# EAGLE design BackplaneBoard (EAGLE 9.1.3)
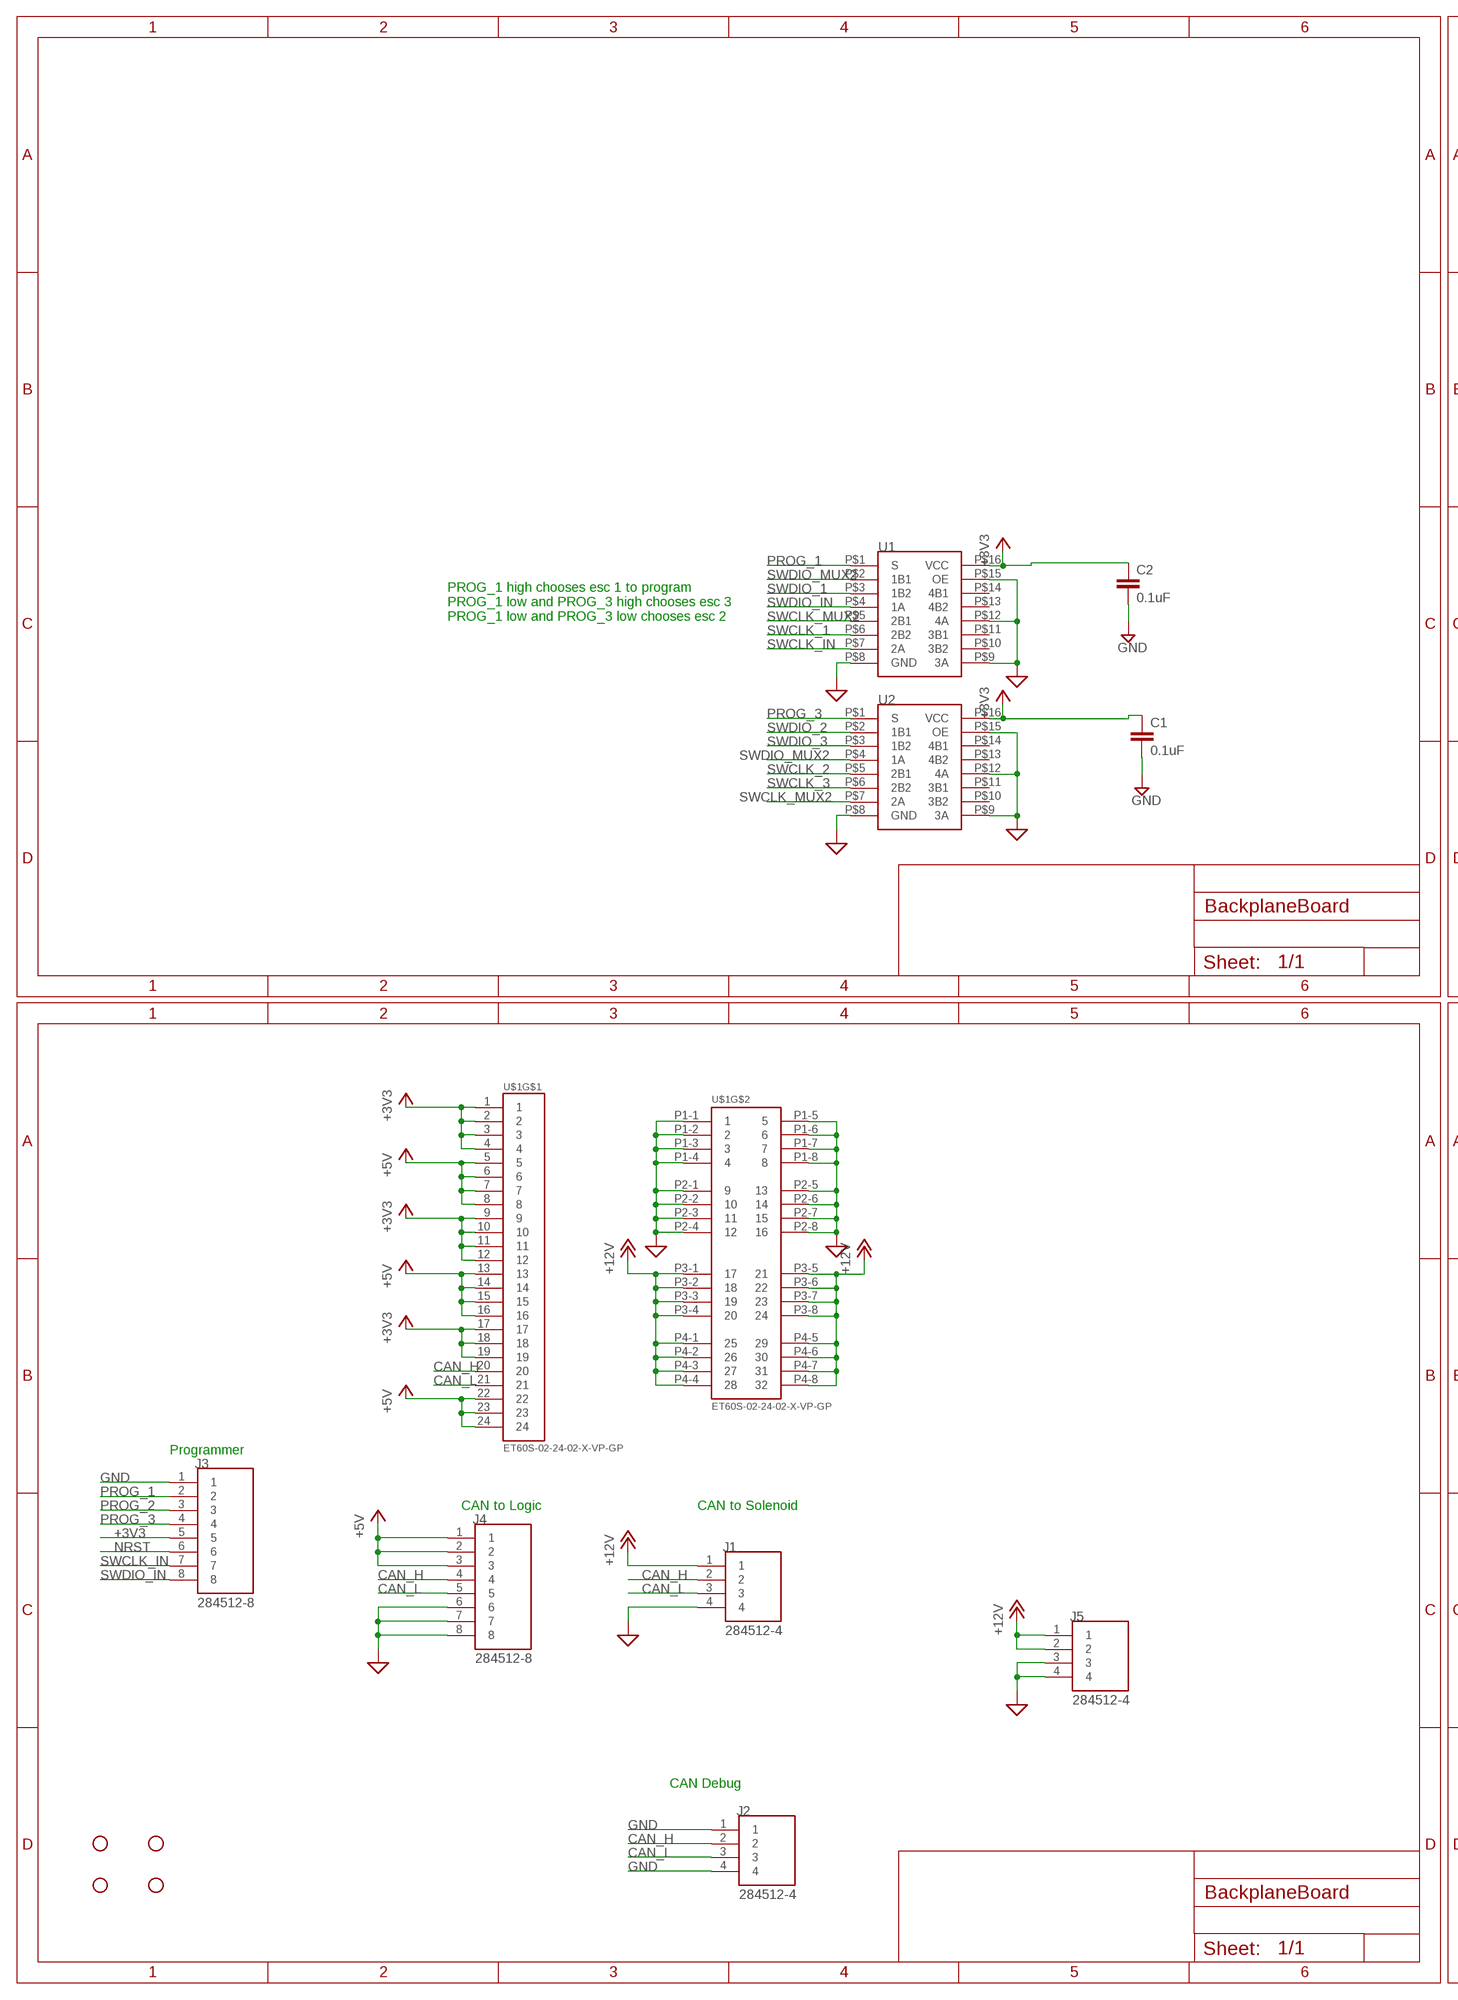
[diagram p0: schematic, sheet 1, part 1 of 2]
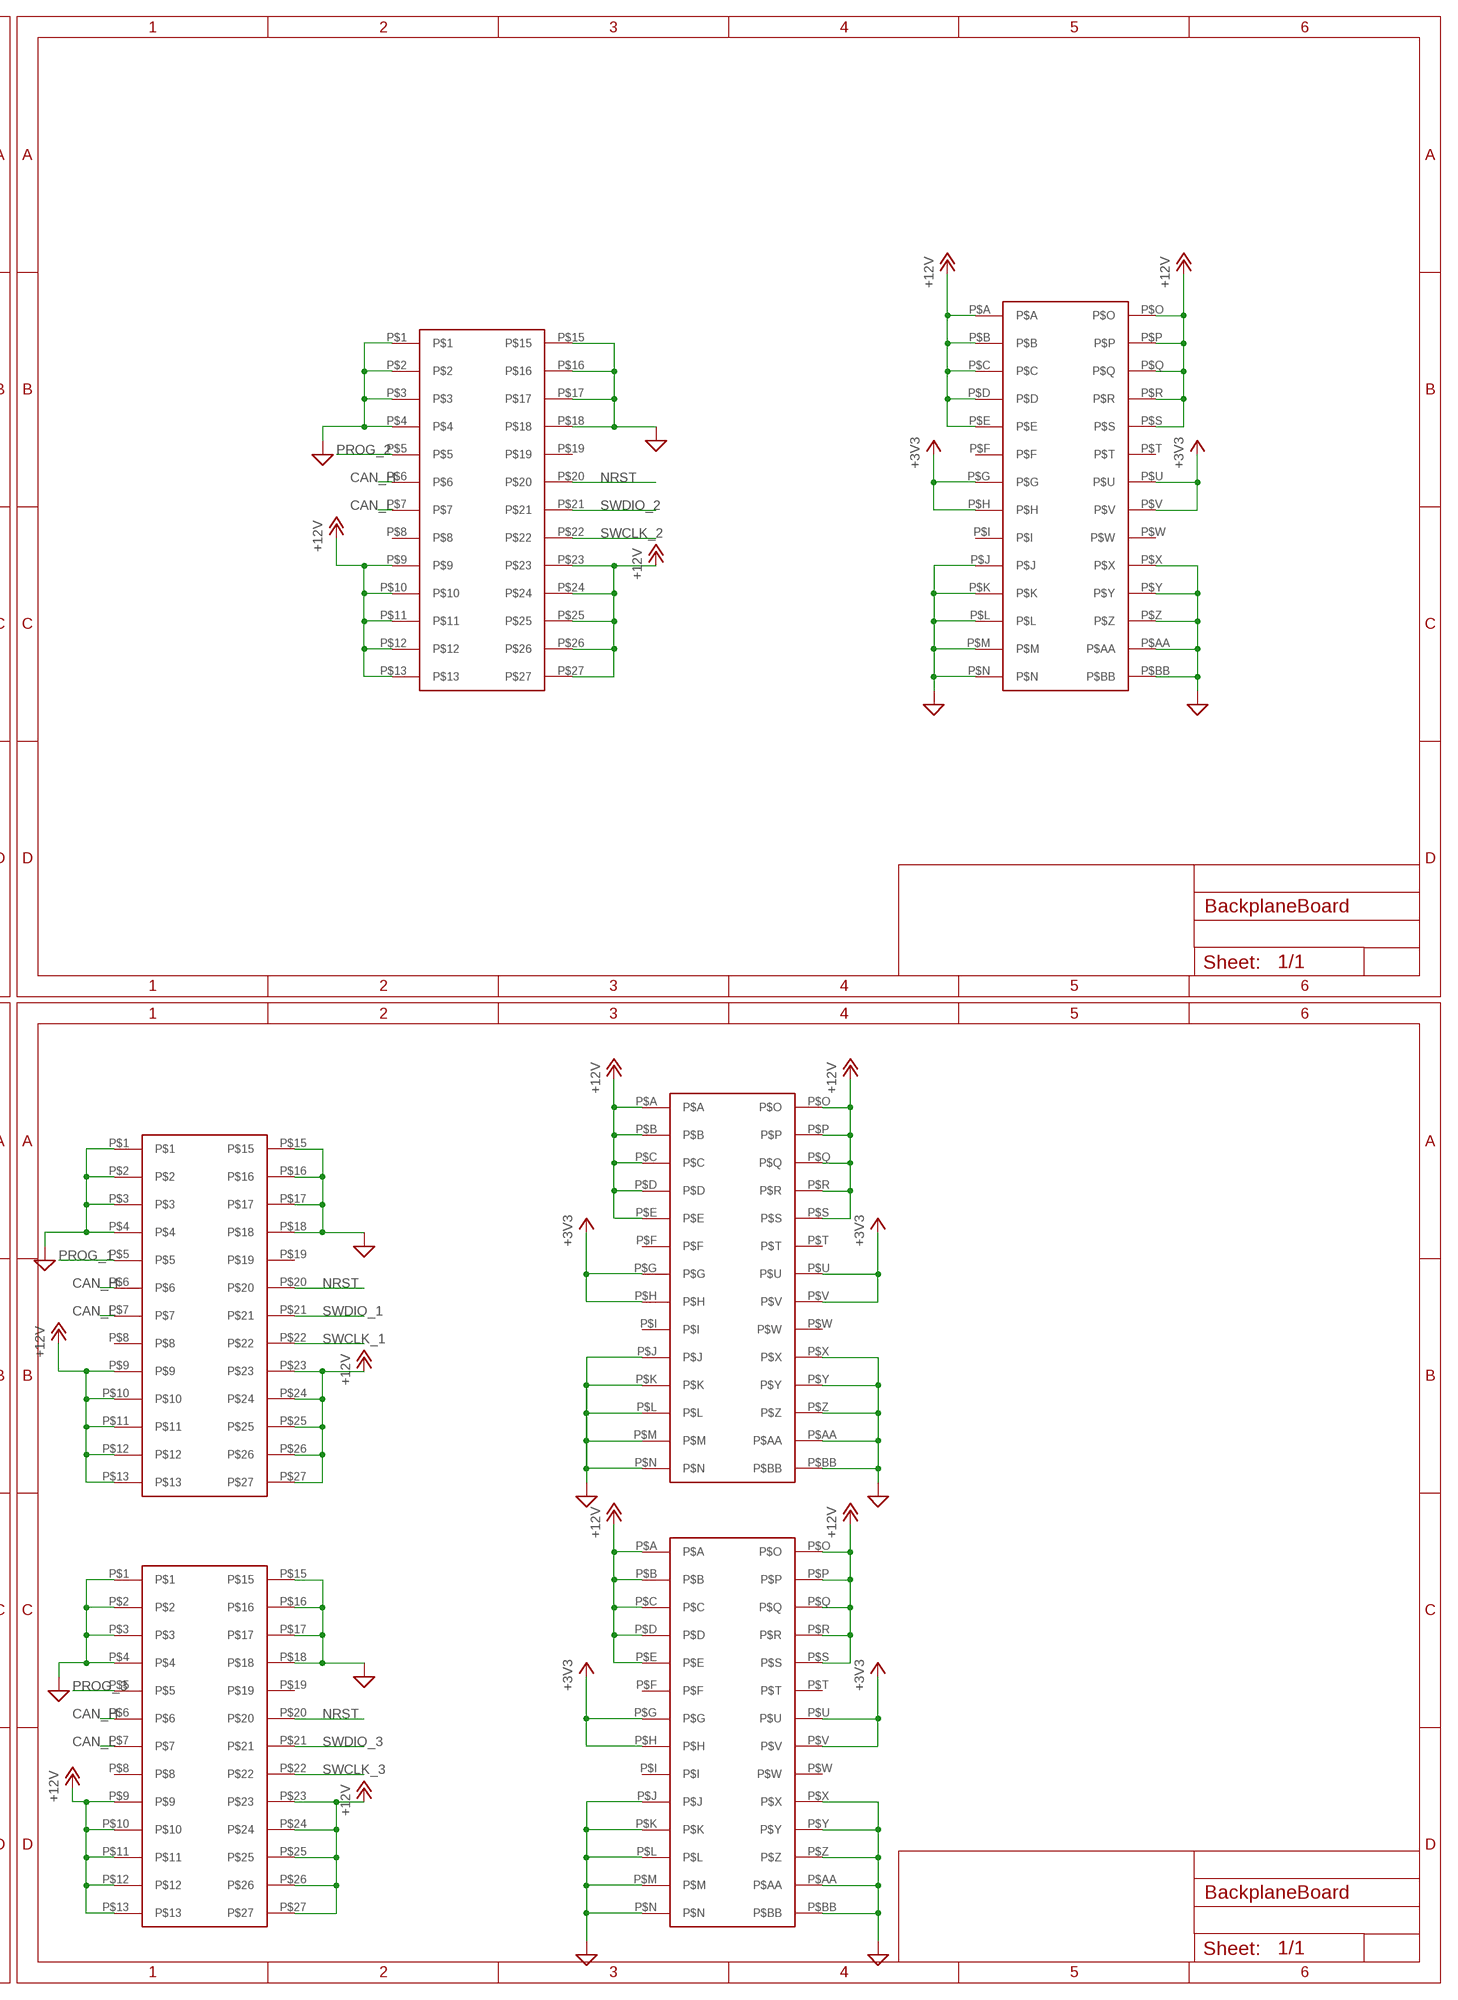
[diagram p1: schematic, sheet 1, part 2 of 2]

## Parts
C1  0.1uF  0.1UF-0603-25V-(+80/-20%)  [0603]
C2  0.1uF  0.1UF-0603-25V-(+80/-20%)  [0603]
H1  STAND-OFF  [STAND-OFF]
H2  STAND-OFF  [STAND-OFF]
H3  STAND-OFF  [STAND-OFF]
H4  STAND-OFF  [STAND-OFF]
J1  284512-4  [TE_284512-4]
J2  284512-4  [TE_284512-4]
J3  284512-8  [TE_284512-8]
J4  284512-8  [TE_284512-8]
J5  284512-4  [TE_284512-4]
U1  SN74CBTLV3257PWR  [SN74CBTLV3257PWR]
U2  SN74CBTLV3257PWR  [SN74CBTLV3257PWR]
U$1  ET60S-02-24-02-X-VP-GP  [ET60S-02-24-02-X-VP-GP]
U$2  ESC2BACKPLANE  [ESC2BACKPLANE_WHOLE]
U$3  ESC2BACKPLANE  [ESC2BACKPLANE_WHOLE]
U$4  ESC2BACKPLANE  [ESC2BACKPLANE_WHOLE]

## Nets
+3V3: C1.1 C2.1 J3.5 U1.P$16(VCC) U2.P$16(VCC) U$1.1 U$1.2 U$1.3 U$1.4 U$1.9 U$1.10 U$1.11 U$1.12 U$1.17 U$1.18 U$1.19 U$2.P$G U$2.P$H U$2.P$U U$2.P$V U$3.P$G U$3.P$H U$3.P$U U$3.P$V U$4.P$G U$4.P$H U$4.P$U U$4.P$V
+5V: J4.1 J4.2 J4.3 U$1.5 U$1.6 U$1.7 U$1.8 U$1.13 U$1.14 U$1.15 U$1.16 U$1.22 U$1.23 U$1.24
+12V: J1.1 J5.1 J5.2 U$1.P3-1 U$1.P3-2 U$1.P3-3 U$1.P3-4 U$1.P3-5 U$1.P3-6 U$1.P3-7 U$1.P3-8 U$1.P4-1 U$1.P4-2 U$1.P4-3 U$1.P4-4 U$1.P4-5 U$1.P4-6 U$1.P4-7 U$1.P4-8 U$2.P$9 U$2.P$10 U$2.P$11 U$2.P$12 U$2.P$13 U$2.P$23 U$2.P$24 U$2.P$25 U$2.P$26 U$2.P$27 U$2.P$A U$2.P$B U$2.P$C U$2.P$D U$2.P$E U$2.P$O U$2.P$P U$2.P$Q U$2.P$R U$2.P$S U$3.P$9 U$3.P$10 U$3.P$11 U$3.P$12 U$3.P$13 U$3.P$23 U$3.P$24 U$3.P$25 U$3.P$26 U$3.P$27 U$3.P$A U$3.P$B U$3.P$C U$3.P$D U$3.P$E U$3.P$O U$3.P$P U$3.P$Q U$3.P$R U$3.P$S U$4.P$9 U$4.P$10 U$4.P$11 U$4.P$12 U$4.P$13 U$4.P$23 U$4.P$24 U$4.P$25 U$4.P$26 U$4.P$27 U$4.P$A U$4.P$B U$4.P$C U$4.P$D U$4.P$E U$4.P$O U$4.P$P U$4.P$Q U$4.P$R U$4.P$S
CAN_H: J1.2 J2.2 J4.4 U$1.20 U$2.P$6 U$3.P$6 U$4.P$6
CAN_L: J1.3 J2.3 J4.5 U$1.21 U$2.P$7 U$3.P$7 U$4.P$7
GND: C1.2 C2.2 J1.4 J2.1 J2.4 J3.1 J4.6 J4.7 J4.8 J5.3 J5.4 U1.P$8(GND) U1.P$9(3A) U1.P$12(4A) U1.P$15(OE) U2.P$8(GND) U2.P$9(3A) U2.P$12(4A) U2.P$15(OE) U$1.P1-1 U$1.P1-2 U$1.P1-3 U$1.P1-4 U$1.P1-5 U$1.P1-6 U$1.P1-7 U$1.P1-8 U$1.P2-1 U$1.P2-2 U$1.P2-3 U$1.P2-4 U$1.P2-5 U$1.P2-6 U$1.P2-7 U$1.P2-8 U$2.P$1 U$2.P$2 U$2.P$3 U$2.P$4 U$2.P$15 U$2.P$16 U$2.P$17 U$2.P$18 U$2.P$AA U$2.P$BB U$2.P$J U$2.P$K U$2.P$L U$2.P$M U$2.P$N U$2.P$X U$2.P$Y U$2.P$Z U$3.P$1 U$3.P$2 U$3.P$3 U$3.P$4 U$3.P$15 U$3.P$16 U$3.P$17 U$3.P$18 U$3.P$AA U$3.P$BB U$3.P$J U$3.P$K U$3.P$L U$3.P$M U$3.P$N U$3.P$X U$3.P$Y U$3.P$Z U$4.P$1 U$4.P$2 U$4.P$3 U$4.P$4 U$4.P$15 U$4.P$16 U$4.P$17 U$4.P$18 U$4.P$AA U$4.P$BB U$4.P$J U$4.P$K U$4.P$L U$4.P$M U$4.P$N U$4.P$X U$4.P$Y U$4.P$Z ; supply symbol labelled SUP
NRST: J3.6 U$2.P$20 U$3.P$20 U$4.P$20
PROG_1: J3.2 U1.P$1(S) U$2.P$5
PROG_2: J3.3 U$3.P$5
PROG_3: J3.4 U2.P$1(S) U$4.P$5
SWCLK_1: U1.P$6(2B2) U$2.P$22
SWCLK_2: U2.P$5(2B1) U$3.P$22
SWCLK_3: U2.P$6(2B2) U$4.P$22
SWCLK_IN: J3.7 U1.P$7(2A)
SWCLK_MUX2: U1.P$5(2B1) U2.P$7(2A)
SWDIO_1: U1.P$3(1B2) U$2.P$21
SWDIO_2: U2.P$2(1B1) U$3.P$21
SWDIO_3: U2.P$3(1B2) U$4.P$21
SWDIO_IN: J3.8 U1.P$4(1A)
SWDIO_MUX2: U1.P$2(1B1) U2.P$4(1A)
Unconnected: U1.P$10(3B2) U1.P$11(3B1) U1.P$13(4B2) U1.P$14(4B1) U2.P$10(3B2) U2.P$11(3B1) U2.P$13(4B2) U2.P$14(4B1) U$2.P$8 U$2.P$19 U$2.P$F U$2.P$I U$2.P$T U$2.P$W U$3.P$8 U$3.P$19 U$3.P$F U$3.P$I U$3.P$T U$3.P$W U$4.P$8 U$4.P$19 U$4.P$F U$4.P$I U$4.P$T U$4.P$W

## Notes on the sheet
- PROG_1 high chooses esc 1 to program
  PROG_1 low and PROG_3 high chooses esc 3
  PROG_1 low and PROG_3 low chooses esc 2
- Programmer
- CAN to Logic | CAN to Solenoid
- CAN Debug

## Library data of the parts
C1 C2 = SparkFun-Capacitors:0.1UF: 0.1µF ceramic capacitors A capacitor is a passive two-terminal electrical component used to store electrical energy temporarily in an electric field.; PROD_ID: CAP-00810
H1-H4 = SparkFun-Hardware:STAND-OFF: Stand Off Drill holes for mechanically mounting via screws, standoffs, etc. Note: Use the keepout ring to avoid running the screw head into surrounding components. Variant Overviews STAND-OFF - Mechanical footprint for a #4 phillips button head screw. STAND-OFF-TIGHT - Mechanical footprint for a #4 phillips button head screw, Example SparkFun Products Screw - Phillips Head (1/4", 4-40, 10 pack) <https://www.sparkfun.com/products/10453> (PRT-10453) Screw - Phillips Head (1/2", 4-40, 10 pack) <https://www.sparkfun.com/products/10452> (PRT-10452) Screw - Phillips Head (3/4", 4-40, 10 pack) <https://www.sparkfun.com/products/10451> (PRT-10451) Screw - Phillips Head (1", 4-40, 10 pack) <https://www.sparkfun.com/products/10450> (PRT-10450)
J1 J2 J5 = 284512-4:284512-4; MANUFACTURER: TE; PARTREV: R; STANDARD: Manufacturer Recommendations
J3 J4 = 284512-8:284512-8; MANUFACTURER: TE; PARTREV: R; STANDARD: Manufacturer Recommendations
U1 U2 = SN74CBTLV3257PWR:SN74CBTLV3257PWR
U$1 = ET60S-02-24-02-X-VP-GP:ET60S-02-24-02-X-VP-GP: VERTICAL SOCKET ET60 POWER ASSEM.
U$2-U$4 = ESC_to_Backplane_Connectors:ESC2BACKPLANE

## Board
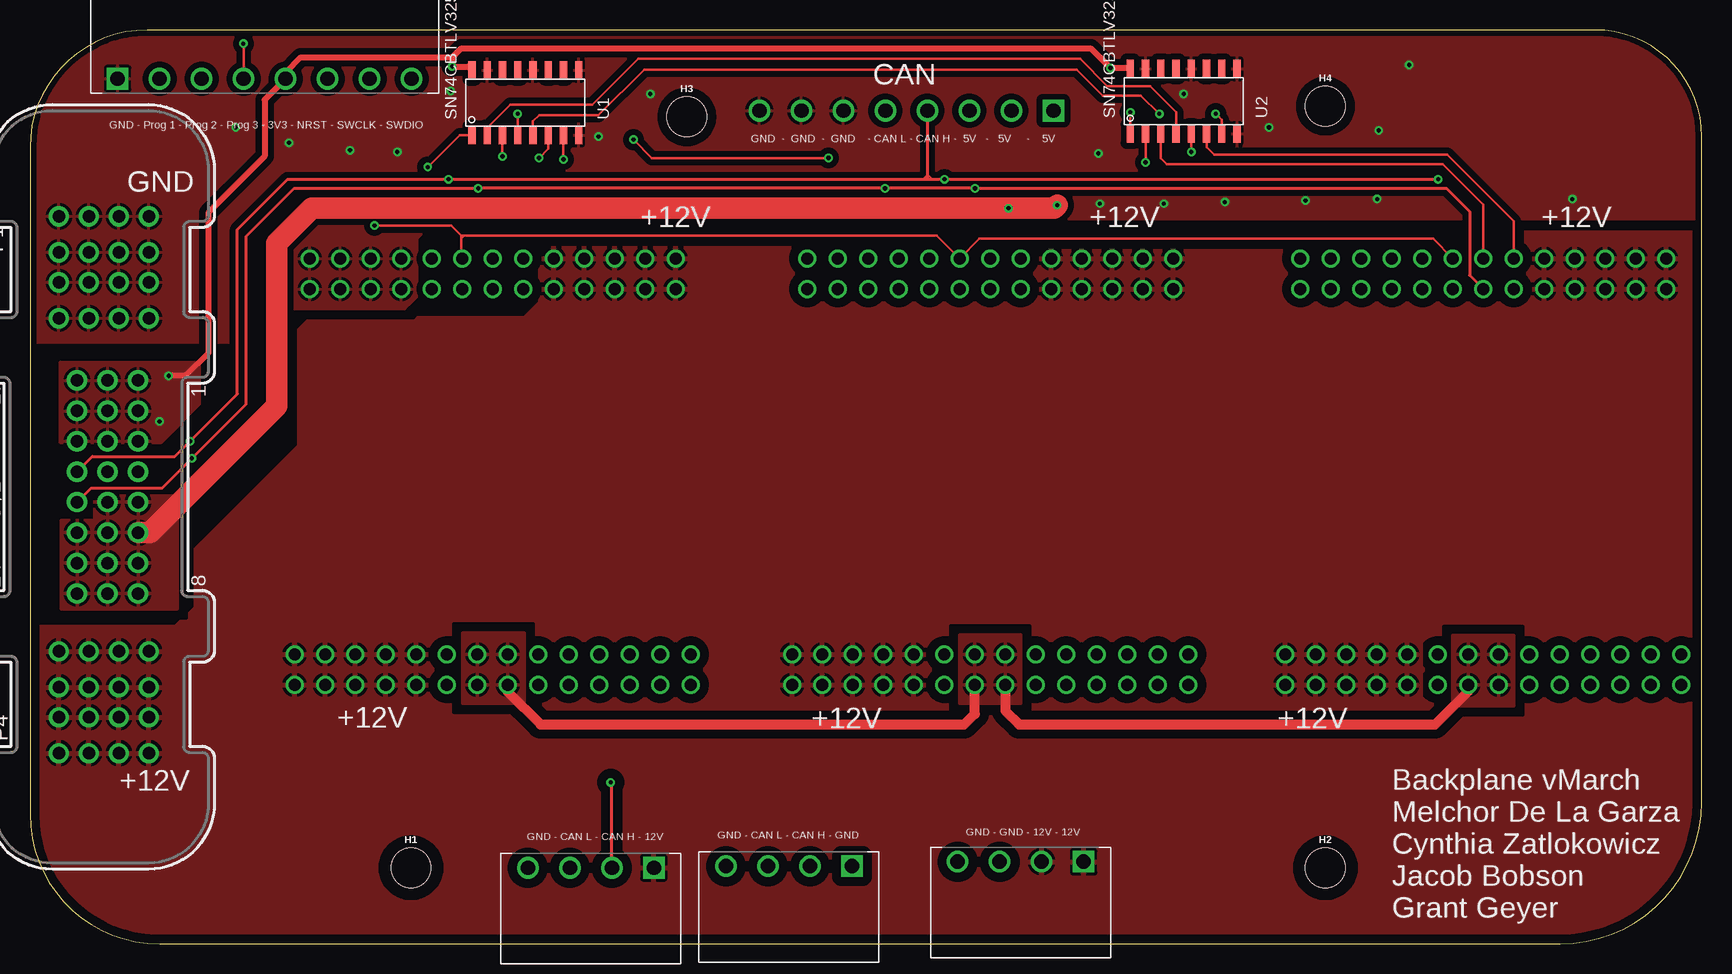
[diagram p2: board, top side]
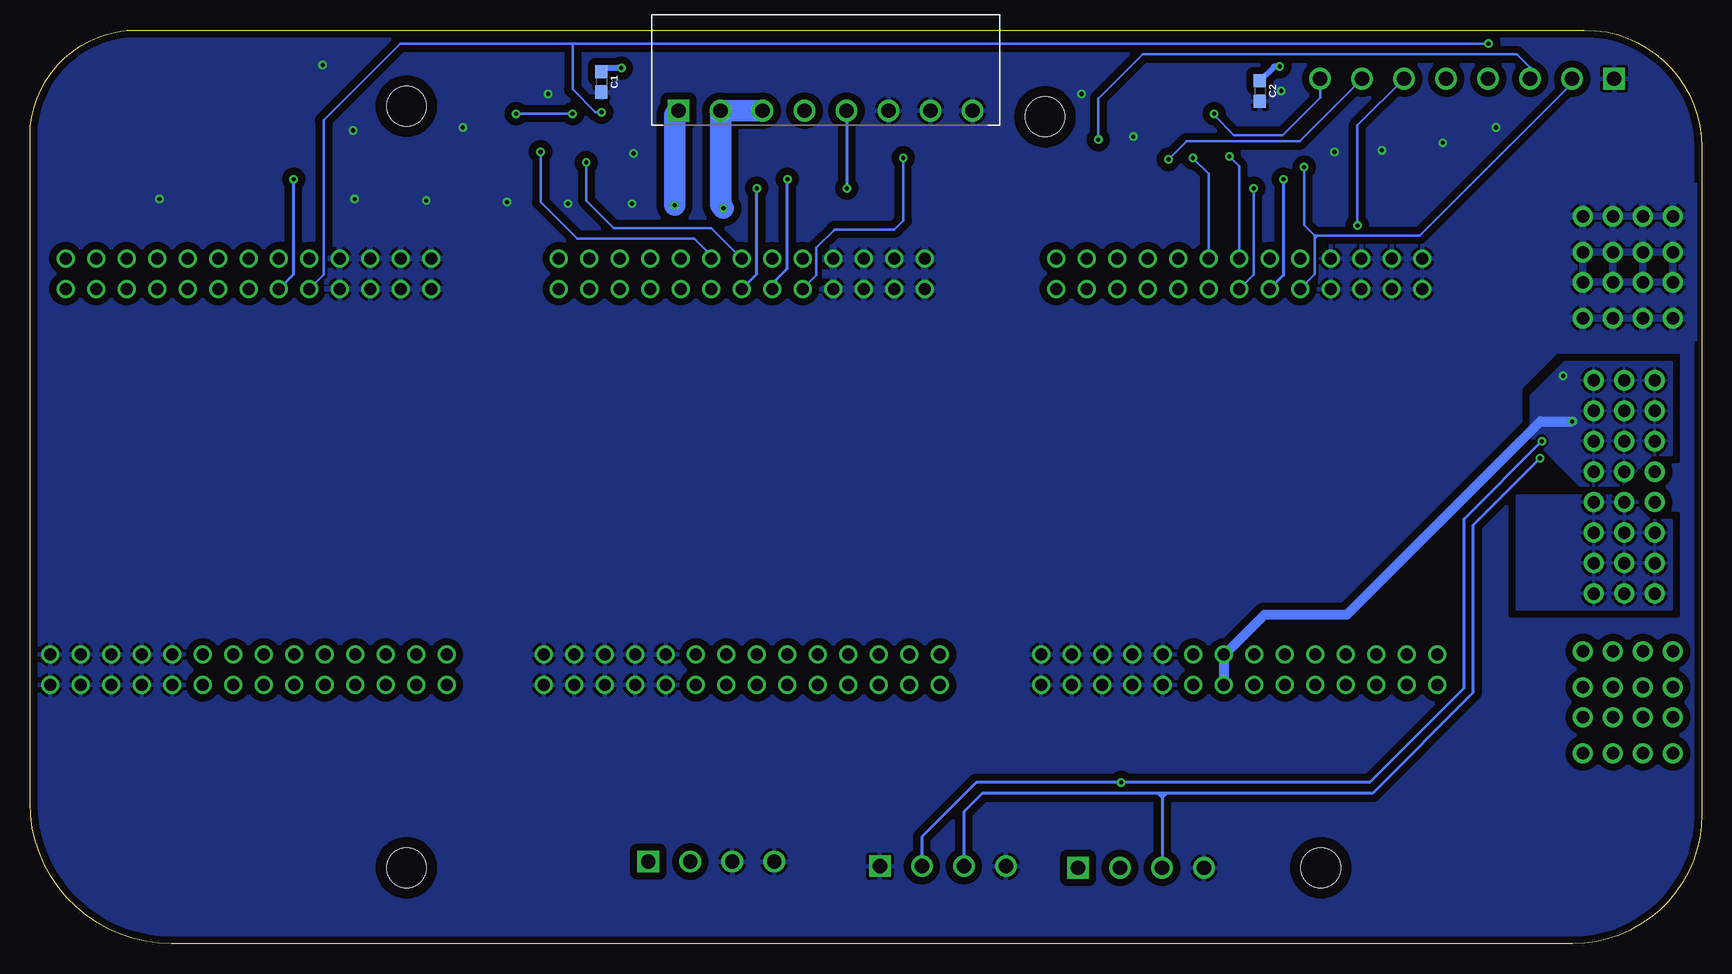
[diagram p3: board, bottom side, seen from below]

Size 139.32 x 76.2 mm. Coordinates in mm from the lower left corner, seen from the top.
Outline: 0,66.42 0,10.79 arc90 10.79,0 127.51,0 arc90 139.32,11.81 139.32,67.31 arc90 130.43,76.2 9.78,76.2 arc90 0,66.42
Copper layers (1*16): Top 0.0356mm / dielectric 1.5011mm / Bottom 0.0356mm
Design rules "ECE_Senior_Design *": minimum track width 8mil, minimum drill 13mil, track to track 8mil, track to pad 8mil, pad to pad 6mil, via to via 8mil, smd to smd 6mil, copper to edge 15mil, drill to drill 8mil, minimum pad ring 7mil, minimum via ring 7mil, stop-mask expansion 3mil, vias tented up to drill 0mil, thermal gap 10mil

### Footprints (pad centres in the part's own frame; a part is rotated, then mirrored left to right if it is on the bottom)
0603 = smd 1.1 x 1: 1 -0.85,0; 2 0.85,0
STAND-OFF = hole 3.302: 0,0
TE_284512-4 = drill 1.2 square: 1 -5.25,0 | drill 1.2: 2 -1.75,0; 3 1.75,0; 4 5.25,0
TE_284512-8 = drill 1.2 square: 1 -12.25,0 | drill 1.2: 2 -8.75,0; 3 -5.25,0; 4 -1.75,0; 5 1.75,0; 6 5.25,0; 7 8.75,0; 8 12.25,0
SN74CBTLV3257PWR = smd 1.55 x 0.6: P$1 0,0; P$2 0,-1.27; P$3 0,-2.54; P$4 0,-3.81; P$5 0,-5.08; P$6 0,-6.35; P$7 0,-7.62; P$8 0,-8.89; P$9 5.4,-8.89; P$10 5.4,-7.62; P$11 5.4,-6.35; P$12 5.4,-5.08; P$13 5.4,-3.81; P$14 5.4,-2.54; P$15 5.4,-1.27; P$16 5.4,0
ET60S-02-24-02-X-VP-GP = drill 1.02 pad 1.676: 1 8.89,-2.84; 2 6.35,-2.84; 3 3.81,-2.84; 4 1.27,-2.84; 5 -1.27,-2.84; 6 -3.81,-2.84; 7 -6.35,-2.84; 8 -8.89,-2.84; 9 8.89,-0.3; 10 6.35,-0.3; 11 3.81,-0.3; 12 1.27,-0.3; 13 -1.27,-0.3; 14 -3.81,-0.3; 15 -6.35,-0.3; 16 -8.89,-0.3; 17 8.89,2.24; 18 6.35,2.24; 19 3.81,2.24; 20 1.27,2.24; 21 -1.27,2.24; 22 -3.81,2.24; 23 -6.35,2.24; 24 -8.89,2.24; P1-1 22.56,-3.75; P1-2 22.56,-1.25; P1-3 22.56,1.25; P1-4 22.56,3.75; P1-5 19.56,-3.75; P1-6 19.56,-1.25; P1-7 19.56,1.25; P1-8 19.56,3.75; P2-1 17.06,-3.75; P2-2 17.06,-1.25; P2-3 17.06,1.25; P2-4 17.06,3.75; P2-5 14.06,-3.75; P2-6 14.06,-1.25; P2-7 14.06,1.25; P2-8 14.06,3.75; P3-1 -13.7,-3.75; P3-2 -13.7,-1.25; P3-3 -13.7,1.25; P3-4 -13.7,3.75; P3-5 -16.7,-3.75; P3-6 -16.7,-1.25; P3-7 -16.7,1.25; P3-8 -16.7,3.75; P4-1 -19.2,-3.75; P4-2 -19.2,-1.25; P4-3 -19.2,1.25; P4-4 -19.2,3.75; P4-5 -22.2,-3.75; P4-6 -22.2,-1.25; P4-7 -22.2,1.25; P4-8 -22.2,3.75
ESC2BACKPLANE_WHOLE = drill 1: P$1 1.27,31.75; P$2 3.81,31.75; P$3 6.35,31.75; P$4 8.89,31.75; P$5 11.43,31.75; P$6 13.97,31.75; P$7 16.51,31.75; P$8 19.05,31.75; P$9 21.59,31.75; P$10 24.13,31.75; P$11 26.67,31.75; P$12 29.21,31.75; P$13 31.75,31.75; P$15 1.27,34.29; P$16 3.81,34.29; P$17 6.35,34.29; P$18 8.89,34.29; P$19 11.43,34.29; P$20 13.97,34.29; P$21 16.51,34.29; P$22 19.05,34.29; P$23 21.59,34.29; P$24 24.13,34.29; P$25 26.67,34.29; P$26 29.21,34.29; P$27 31.75,34.29; P$A 0,-1.27; P$AA 30.48,1.27; P$B 2.54,-1.27; P$BB 33.02,1.27; P$C 5.08,-1.27; P$D 7.62,-1.27; P$E 10.16,-1.27; P$F 12.7,-1.27; P$G 15.24,-1.27; P$H 17.78,-1.27; P$I 20.32,-1.27; P$J 22.86,-1.27; P$K 25.4,-1.27; P$L 27.94,-1.27; P$M 30.48,-1.27; P$N 33.02,-1.27; P$O 0,1.27; P$P 2.54,1.27; P$Q 5.08,1.27; P$R 7.62,1.27; P$S 10.16,1.27; P$T 12.7,1.27; P$U 15.24,1.27; P$V 17.78,1.27; P$W 20.32,1.27; P$X 22.86,1.27; P$Y 25.4,1.27; P$Z 27.94,1.27

### Placement (x,y rotation side)
C1  91.69,71.88 270 bottom
C2  36.83,71.12 270 bottom
H1  31.75,6.35 0 top
H2  107.95,6.35 0 top
H3  54.74,68.96 0 top
H4  107.95,69.85 0 top
J1  46.74,6.35 180 top
J2  63.25,6.48 180 top
J3  19.56,72.14 0 top
J4  73.03,69.47 0 bottom
J5  82.55,6.86 180 top
U1  36.83,67.44 90 top
U2  91.69,67.56 90 top
U$1  6.16,38.1 90 top
U$2  22.04,22.86 0 top
U$3  63.5,22.86 0 top
U$4  104.6,22.86 0 top

### Tracks (layer width: path | path; a pad name or v marks a point on that pad's centre or on a via)
+3V3  (via drill 0.35)
  Top 0.508: U1.P$16 36.52,73.15 v35.18,73.15 35.18,73.91 | 35.18,73.91 35.94,74.68 88.39,74.68 v90.04,73.03 91.63,73.03 U2.P$16 | v11.56,47.37 12.95,47.37 14.86,49.28 14.86,60.96 19.56,65.66 19.56,70.39 J3.5 21.31,72.64 22.58,73.91 34.42,73.91 35.18,73.91
  Top 0.813: U$2.P$H 39.82,21.01 42.55,18.29 77.85,18.29 78.74,19.18 U$3.P$G | U$3.P$H 81.28,19.43 82.42,18.29 117.09,18.29 119.84,21.03 U$4.P$G
  Bottom 0.508: v35.18,73.15 35.65,73.15 C2.1 | v90.04,73.03 91.4,73.03 C1.1
  Bottom 0.813: U$2.P$H U$2.P$V 39.75,24.13 36.45,27.43 29.59,27.43 13.46,43.56 v10.79,43.56
  pour Top: 41.17,24.06 41.17,25.92 36.07,25.92 36.07,20.06 41.17,20.06
  pour Top: 118.57,19.84 118.57,25.73 123.65,25.73 123.65,19.84
  pour Top: 77.47,20.04 77.47,25.76 82.55,25.76 82.55,20.04
  pour Bottom: 6.73,38.23 7.11,38.23 10.16,38.23 14.22,42.29 14.22,45.72 11.43,48.51 2.54,48.51 2.54,40.77 4.19,40.77
  pour Top: 2.54,41.78 2.54,48.51 14.1,48.51 14.1,44.96 13.84,44.7 10.92,41.78
+5V  (via drill 0.35)
  Top 1.778: U$1.6 10.03,34.29 20.57,44.83 20.57,58.42 23.5,61.34 v81.53,61.34 85.34,61.34 v85.6,61.59
  Bottom 1.778: v85.6,61.59 85.6,69.15 J4.1 | v81.53,61.34 81.78,61.58 J4.2 J4.3
  pour Top: 12.26,37.34 5.4,37.34 5.4,35.31 2.6,35.31 2.6,27.94 12.26,27.94
  pour Bottom: 2.59,27.94 15.39,27.94 15.39,37.34 5.38,37.34 5.38,36.37 4.32,35.31 2.69,35.31 2.57,35.31 2.57,27.94
+12V
  pour Top: 104,25 104,20.5 116,20.5 116,25
  pour Top (isolate 0.762, rank 2): -1.52,26.42 12.19,26.42 12.83,27.05 13.84,28.07 13.84,32.89 22.48,41.53 22.48,51.18 23.5,52.2 26.04,52.2 41.27,52.2 42.55,53.47 42.55,58.42 43.43,59.31 142.24,59.31 142.24,-4.06 -2.16,-4.06 -2.16,26.42
CAN_H  (via drill 0.35)
  Top 0.203: 75.18,63.75 74.8,64.14 74.42,63.75 74.3,63.75
  Top 0.254: U$1.20 5.19,40.64 12.06,40.64 v13.34,41.91 17.27,45.85 17.27,59.56 21.46,63.75 v34.87,63.75 74.3,63.75 74.8,63.75 | 74.8,63.75 75.18,63.75 v76.2,63.75 81.53,63.75 v117.35,63.75 | 74.8,63.75 74.8,64.14 74.8,69.44 J4.4 | J1.2 48.49,13.36 v48.39,13.46
  Bottom 0.254: v34.87,63.75 34.87,55.76 U$2.P$6 | U$4.P$6 117.36,55.81 117.36,63.74 v117.35,63.75 | U$3.P$6 77.47,55.05 76.2,56.32 v76.2,63.75 | v13.34,41.91 19.81,35.43 19.81,21.34 27.69,13.46 v48.39,13.46 60.45,13.46 65,8.92 J2.2
CAN_L  (via drill 0.35)
  Top 0.254: U$1.21 5.09,38 11,38 v13.49,40.49 18,45 18,59 22,63 v37.35,63 v71.25,63 v78.75,63 83.57,63 118.03,63 119.97,61.06 119.97,55.74 U$4.P$7
  Bottom 0.203: U$2.P$7 37.35,55.81 v37.35,63
  Bottom 0.254: 44.58,12.57 27.43,12.57 19.05,20.95 19.05,34.92 v13.49,40.49 | 44.58,12.57 44.96,12.57 | 44.96,12.57 45.34,12.57 | 45.34,12.57 59.94,12.57 61.5,11.02 J2.3 | U$3.P$7 78.75,55.87 v78.75,63 | J4.5 71.28,63.03 v71.25,63 | 44.96,12.57 44.96,12.19 | 44.96,12.19 44.96,6.38 J1.3 | 44.96,12.19 44.58,12.57 | 44.96,12.19 45.34,12.57
GND  (via drill 0.35)
  other vias: 35.05,71.12 47.37,67.31 103.25,68.07 96.14,70.87 51.69,70.87 89.03,65.91 99.57,61.85 112.27,62.1 106.3,61.98 94.49,61.72 89.15,61.72 30.61,66.04 26.67,66.17 21.59,66.8 17.14,68.07 112.39,67.82 114.94,73.28 128.52,62.1
  pour Bottom: 23,58 23,54 31.9,54 31.9,58
  pour Bottom: 64,58 64,54 73,54 73,58
  pour Bottom: 104.77,57.87 104.77,54 114.53,54 114.53,57.87
  pour Bottom: 12.38,50.55 12.38,63.12 -1.46,63.12 -1.46,50.55
  pour Bottom (isolate 0.61, rank 3): 140.21,79.3 140.21,-1.4 -0.89,-1.4 -0.89,50.93 11.68,50.93 11.68,62.48 -0.89,62.48 -0.89,79.3
  pour Top (isolate 0.508): -2.92,50.16 13.59,50.16 18.8,50.16 21.08,52.45 21.46,52.83 21.46,52.96 31.24,52.96 31.88,53.59 32.26,53.98 32.26,58.8 33.91,60.45 141.86,60.45 141.86,80.01 -2.92,80.01
NRST  (via drill 0.35)
  Top 0.203: v28.7,59.9 35.1,59.9 35.94,59.05 | U$4.P$20 116.92,58.8 79.12,58.8 U$3.P$20 75.56,59.05 36.2,59.05 | 36.2,59.05 35.94,59.05 | 35.94,59.05 35.94,58.8 | 35.94,58.8 35.94,57.22 U$2.P$20 | 36.2,59.05 35.94,58.8
  Bottom 0.203: J3.6 28.7,68.24 v28.7,59.9
PROG_1  (via drill 0.35)
  Top 0.203: v33.15,64.77 35.81,67.44 U1.P$1
  Bottom 0.203: U$2.P$5 32.26,55.83 32.26,58.8 | J3.2 10.81,71.74 23.5,59.05 32,59.05 | 32.26,59.05 33.15,59.94 v33.15,64.77 | 32,59.05 32.26,59.05 | 32.26,58.8 32.26,59.05 | 32,59.05 32.26,58.8
PROG_2  (via drill 0.35)
  Top 0.203: v66.55,65.53 51.82,65.53 v50.29,67.06
  Bottom 0.203: U$3.P$5 73.79,55.75 73.79,58.04 72.26,59.56 67.31,59.56 66.55,60.33 v66.55,65.53 | v50.29,67.06 50.29,70.48 46.61,74.17 15.44,74.17 14.31,73.04 J3.3
PROG_3  (via drill 0.35)
  Top 0.203: v91.69,69.34 U2.P$1 | J3.4 17.81,75.03 v17.78,75.06
  Bottom 0.203: v17.78,75.06 94.11,75.06 | 94.11,75.06 108.46,75.06 114.85,68.67 114.85,55.79 U$4.P$5 | 94.11,75.06 94.11,71.25 92.2,69.34 v91.69,69.34
SWCLK_1  (via drill 0.35)
  Top 0.203: v42.42,65.53 43.18,66.29 U1.P$6
  Bottom 0.203: U$2.P$22 41.09,64.21 v42.42,65.53
SWCLK_2  (via drill 0.35)
  Top 0.203: U2.P$5 v96.77,66.04
  Bottom 0.203: v96.77,66.04 96.77,61.85 93.73,58.8 83.95,58.8 82.55,57.4 U$3.P$22
SWCLK_3
  Top 0.203: U$4.P$22 123.65,60.25 118.11,65.79 98.68,65.79 98.04,66.42 U2.P$6
SWCLK_IN  (via drill 0.35)
  Top 0.203: U1.P$7 v44.45,65.41
  Bottom 0.203: v44.45,65.41 42.93,66.93 33.52,66.93 J3.7
SWCLK_MUX2  (via drill 0.35)
  Top 0.203: U2.P$7 99.31,68.71 v98.81,69.22 | U1.P$5 41.91,68.58 42.42,69.09 47.37,69.09 51.18,72.9 87.25,72.9 89.41,70.74 92.58,70.74 v94.11,69.22
  Bottom 0.203: v94.11,69.22 v98.81,69.22
SWDIO_1  (via drill 0.35)
  Top 0.203: v39.37,65.66 U1.P$3
  Bottom 0.203: U$2.P$21 38.55,64.84 v39.37,65.66
SWDIO_2  (via drill 0.35)
  Top 0.203: U2.P$2 v92.96,65.15
  Bottom 0.203: v92.96,65.15 92.96,61.98 90.68,59.69 82.55,59.69 U$3.P$21
SWDIO_3
  Top 0.203: U$4.P$21 121.11,61.64 117.73,65.02 94.74,65.02 94.23,65.53 U2.P$3
SWDIO_IN  (via drill 0.35)
  Top 0.203: v40.64,69.22 U1.P$4
  Bottom 0.203: v40.64,69.22 40.64,69.09 38.99,67.44 34.92,67.44 31.81,70.55 J3.8
SWDIO_MUX2
  Top 0.203: U1.P$2 38.1,68.07 40.01,69.98 46.86,69.98 50.67,73.79 87.5,73.79 89.79,71.5 93.34,71.5 95.5,69.34 U2.P$4

### Text on the board
tNames: CAN | GND - Prog 1 - Prog 2 - Prog 3 - 3V3 - NRST - SWCLK - SWDIO | GND - GND - GND - CAN L - CAN H - 5V - 5V - 5V | GND | +12V | +12V | +12V | +12V | +12V | +12V | +12V | GND - CAN L - CAN H - 12V | GND - CAN L - CAN H - GND | GND - GND - 12V - 12V | Backplane vMarch / Melchor De La Garza / Cynthia Zatlokowicz / Jacob Bobson / Grant Geyer